# EAGLE schematic panel_controller_rev_c (EAGLE 5.06)

## Sheet 1 of 2
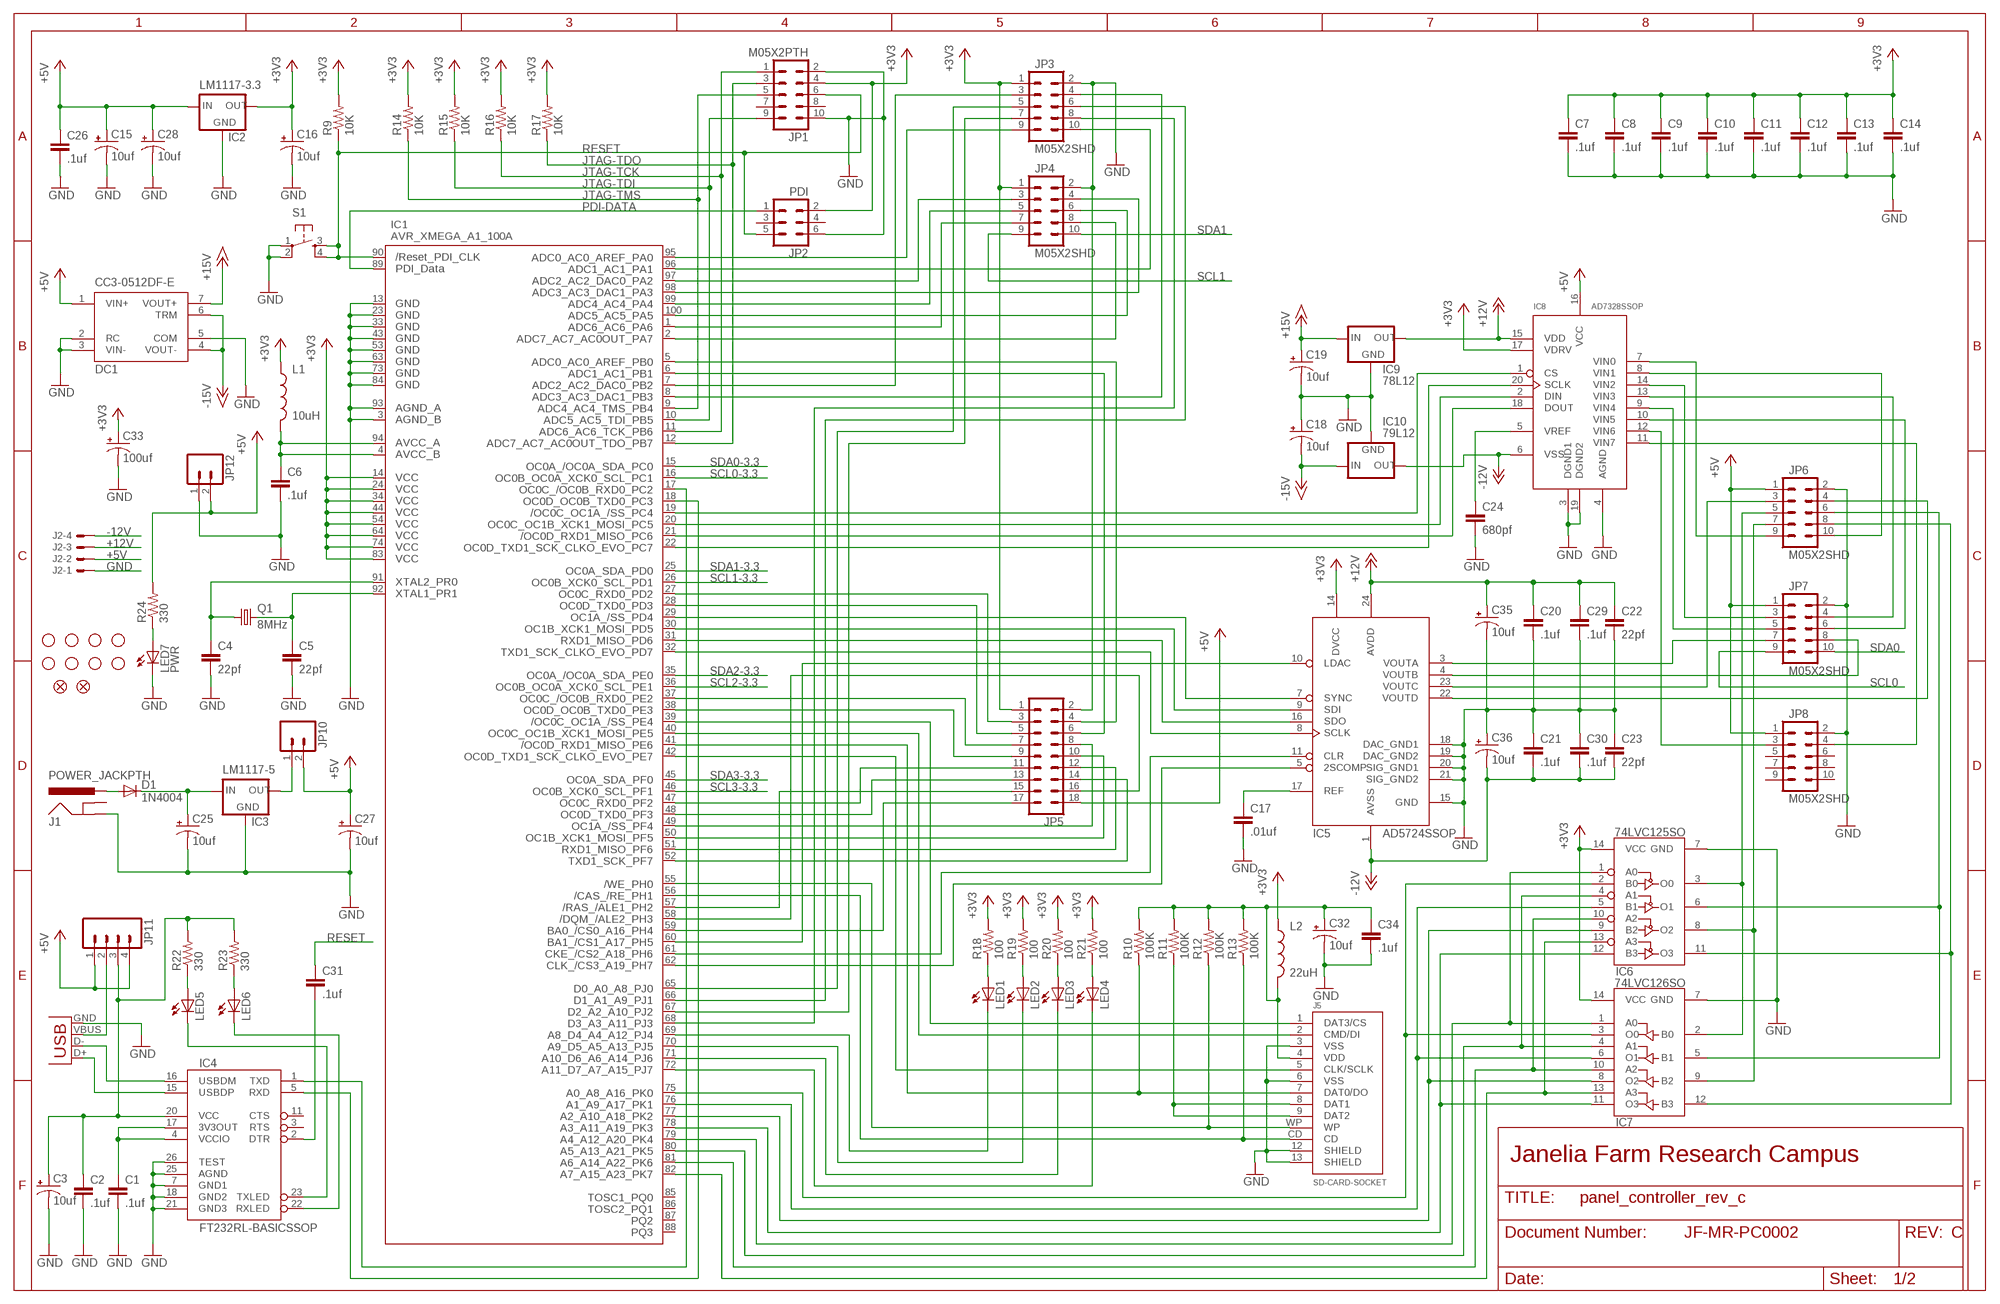
[diagram p0: schematic, sheet 1]

### Parts
C1  .1uf  CAP0603  [0603]
C2  .1uf  CAP0603  [0603]
C3  10uf  CAP_POL1206  [EIA3216]
C4  22pf  CAP0603  [0603]
C5  22pf  CAP0603  [0603]
C6  .1uf  CAP0603  [0603]
C7  .1uf  CAP0603  [0603]
C8  .1uf  CAP0603  [0603]
C9  .1uf  CAP0603  [0603]
C10  .1uf  CAP0603  [0603]
C11  .1uf  CAP0603  [0603]
C12  .1uf  CAP0603  [0603]
C13  .1uf  CAP0603  [0603]
C14  .1uf  CAP0603  [0603]
C15  10uf  CAP_POL1206  [EIA3216]
C16  10uf  CAP_POL1206  [EIA3216]
C17  .01uf  CAP0603  [0603]
C18  10uf  CAP_POL1206  [EIA3216]
C19  10uf  CAP_POL1206  [EIA3216]
C20  .1uf  CAP0603  [0603]
C21  .1uf  CAP0603  [0603]
C22  22pf  CAP0603  [0603]
C23  22pf  CAP0603  [0603]
C24  680pf  CAP0603  [0603]
C25  10uf  CAP_POL1206  [EIA3216]
C26  .1uf  CAP0603  [0603]
C27  10uf  CAP_POL1206  [EIA3216]
C28  10uf  CAP_POL1206  [EIA3216]
C29  .1uf  CAP0603  [0603]
C30  .1uf  CAP0603  [0603]
C31  .1uf  CAP0603  [0603]
C32  10uf  CAP_POL1206  [EIA3216]
C33  100uf  CAP_POLE  [PANASONIC_E]
C34  .1uf  CAP0603  [0603]
C35  10uf  CAP_POL1206  [EIA3216]
C36  10uf  CAP_POL1206  [EIA3216]
D1  1N4004  [DO41-10]
DC1  CC3-0512DF-E  [CC3-TH]
IC1  AVR_XMEGA_A1_100A  [TQFP100]
IC2  LM1117-3.3  V_REG_LM1117SOT223  [SOT223]
IC3  LM1117-5  V_REG_LM1117SOT223  [SOT223]
IC4  FT232RL-BASICSSOP  [SSOP28DB]
IC5  AD5724SSOP  [TSSOP24]
IC6  74LVC125SO  [SO014]
IC7  74LVC126SO  [SO014]
IC8  AD7328SSOP  [TSSOP20]
IC9  78L12  78LXXSOT89  [SOT89]
IC10  79L12  79LXXSOT89  [SOT89]
J1  POWER_JACKPTH  [POWER_JACK_PTH]
J2  KK-156-4  [KK-156-4]
J3  USBPTH  [USB-B-PTH]
J5  SD-CARD-SOCKET  [SD-MMC_SOCKET-3M]
JP1  M05X2PTH  MA05-2  [MA05-2]
JP2  PDI  MA03-2  [MA03-2]
JP3  M05X2SHD  [2X5-SHROUDED]
JP4  M05X2SHD  [2X5-SHROUDED]
JP5  MA09-2  [MA09-2]
JP6  M05X2SHD  [2X5-SHROUDED]
JP7  M05X2SHD  [2X5-SHROUDED]
JP8  M05X2SHD  [2X5-SHROUDED]
JP10  M02PTH  [1X02]
JP11  M04PTH  [1X04]
JP12  M02PTH  [1X02]
L1  10uH  INDUCTOR0805  [0805]
L2  22uH  INDUCTOR0805  [0805]
LED1  LED3MM  [LED3MM]
LED2  LED3MM  [LED3MM]
LED3  LED3MM  [LED3MM]
LED4  LED3MM  [LED3MM]
LED5  LED3MM  [LED3MM]
LED6  LED3MM  [LED3MM]
LED7  PWR  LED3MM  [LED3MM]
Q1  8MHz  CRYSTALSMD  [HC49UP]
R9  10K  RESISTOR0603  [0603]
R10  100K  RESISTOR0603  [0603]
R11  100K  RESISTOR0603  [0603]
R12  100K  RESISTOR0603  [0603]
R13  100K  RESISTOR0603  [0603]
R14  10K  RESISTOR0603  [0603]
R15  10K  RESISTOR0603  [0603]
R16  10K  RESISTOR0603  [0603]
R17  10K  RESISTOR0603  [0603]
R18  100  RESISTOR0603  [0603]
R19  100  RESISTOR0603  [0603]
R20  100  RESISTOR0603  [0603]
R21  100  RESISTOR0603  [0603]
R22  330  RESISTOR0603  [0603]
R23  330  RESISTOR0603  [0603]
R24  330  RESISTOR0603  [0603]
S1  TAC_SWITCHB3S-1000  [OMRON]
U$1  FIDUCIAL1X2  [FIDUCIAL-1X2]
U$2  FIDUCIAL1X2  [FIDUCIAL-1X2]
U$3  STAND-OFF  [STAND-OFF]
U$4  STAND-OFF  [STAND-OFF]
U$5  STAND-OFF  [STAND-OFF]
U$6  STAND-OFF  [STAND-OFF]
U$7  STAND-OFF  [STAND-OFF]
U$8  STAND-OFF  [STAND-OFF]
U$9  STAND-OFF  [STAND-OFF]
U$10  STAND-OFF  [STAND-OFF]

### Nets
+3V3 [power]: C7.1 C8.1 C9.1 C10.1 C11.1 C12.1 C13.1 C14.1 C16.A(+) C33.+ IC1.14(VCC1) IC1.24(VCC2) IC1.34(VCC3) IC1.44(VCC4) IC1.54(VCC5) IC1.64(VCC6) IC1.74(VCC7) IC1.83(VCC8) IC2.2(OUT) IC5.14(DVCC) IC6.14(VCC) IC7.14(VCC) IC8.17(VDRV) JP1.4 JP2.2 JP3.1 JP4.1 JP5.1 L1.1 L2.1 R9.2 R14.2 R15.2 R16.2 R17.2 R18.2 R19.2 R20.2 R21.2 ; also sheet 2
+5V [power]: C15.A(+) C26.1 C27.A(+) C28.A(+) DC1.1(VIN+) IC2.3(IN) IC8.16(VCC) J2.2 JP5.18 JP6.1 JP7.1 JP8.1 JP10.2 JP11.1 JP11.4 JP12.2 R24.2 ; also sheet 2
+12V [power]: C20.1 C22.1 C29.1 C35.A(+) IC5.24(AVDD) IC8.15(VDD) IC9.1(OUT) J2.3
+15V: C19.A(+) DC1.7(VOUT+) IC9.3(IN)
-12V [power]: C21.2 C23.2 C30.2 C36.C(-) IC5.1(AVSS) IC8.6(VSS) IC10.3(OUT) J2.4
-15V: C18.C(-) DC1.4(VOUT-) DC1.6(TRM) IC10.2(IN)
GND [power]: C1.2 C2.2 C3.C(-) C4.2 C5.2 C6.2 C7.2 C8.2 C9.2 C10.2 C11.2 C12.2 C13.2 C14.2 C15.C(-) C16.C(-) C17.2 C18.A(+) C19.C(-) C20.2 C21.1 C22.2 C23.1 C24.2 C25.C(-) C26.2 C27.C(-) C28.C(-) C29.2 C30.1 C32.C(-) C33.- C34.2 C35.C(-) C36.A(+) DC1.2(RC) DC1.3(VIN-) DC1.5(COM) IC1.3(AGND_B) IC1.13(GND1) IC1.23(GND2) IC1.33(GND3) IC1.43(GND4) IC1.53(GND5) IC1.63(GND6) IC1.73(GND7) IC1.84(GND8) IC1.93(AGND_A) IC2.1(GND) IC3.1(GND) IC4.7(GND1) IC4.18(GND2) IC4.21(GND3) IC4.25(AGND) IC4.26(TEST) IC5.15(GND) IC5.18(DAC_GND1) IC5.19(DAC_GND2) IC5.20(SIG_GND1) IC5.21(SIG_GND2) IC6.7(GND) IC7.7(GND) IC8.3(DGND1) IC8.4(AGND) IC8.19(DGND2) IC9.2(GND) IC10.1(GND) J1.GND J2.1 J3.GND J5.3(VSS) J5.6(VSS) J5.12(SHIELD) J5.13(SHIELD) JP1.2 JP1.10 JP2.6 JP3.2 JP4.2 JP5.2 JP6.2 JP7.2 JP8.2 JP12.1 LED7.K(C) S1.1 S1.2 ; also sheet 2
JTAG-TCK: IC1.11(PB6) JP1.1 R16.1
JTAG-TDI: IC1.10(PB5) JP1.9 R15.1
JTAG-TDO: IC1.12(PB7) JP1.3 R17.1
JTAG-TMS: IC1.9(PB4) JP1.5 R14.1
N$9: IC4.16(USBDM) J3.D-
N$10: IC4.15(USBDP) J3.D+
N$11: J3.VBUS JP11.2
N$12: C1.1 IC4.4(VCCIO) IC4.17(3V3OUT)
N$13: IC1.18(PC3) IC4.5(RXD)
N$14: IC1.19(PC4) IC8.1(CS)
N$15: IC1.57(PH2) JP5.15
N$16: IC1.65(PJ0) JP3.5
N$17: IC1.67(PJ2) JP3.7
N$18: IC1.17(PC2) IC4.1(TXD)
N$19: LED5.A R22.1
N$20: IC1.40(PE5) J5.2(CMD/DI)
N$21: IC1.41(PE6) J5.7(DAT0/DO) R10.1
N$22: IC1.42(PE7) J5.5(CLK/SCLK)
N$23: IC1.39(PE4) J5.1(DAT3/CS)
N$24: IC1.69(PJ4) LED1.K(C)
N$25: IC1.70(PJ5) LED2.K(C)
N$26: C4.1 IC1.91(PR0) Q1.1
N$27: C5.1 IC1.92(PR1) Q1.2
N$28: IC1.71(PJ6) LED3.K(C)
N$29: IC1.72(PJ7) LED4.K(C)
N$30: LED1.A R18.1
N$31: C6.1 IC1.4(AVCC_B) IC1.94(AVCC_A) L1.2
N$32: LED2.A R19.1
N$33: LED3.A R20.1
N$34: LED4.A R21.1
N$35: IC1.66(PJ1) JP3.6
N$36: IC1.68(PJ3) JP3.8
N$37: IC1.2(PA7) JP4.8
N$38: IC1.1(PA6) JP4.7
N$39: IC1.100(PA5) JP4.6
N$40: J5.8(DAT1) J5.9(DAT2) R11.1
N$41: IC1.55(PH0) J5.WP R12.1
N$42: IC1.56(PH1) J5.CD R13.1
N$43: IC1.99(PA4) JP4.5
N$44: IC1.98(PA3) JP4.4
N$45: IC1.97(PA2) JP4.3
N$46: IC1.96(PA1) JP3.10
N$47: IC1.95(PA0) JP3.9
N$48: IC1.7(PB2) JP3.3
N$49: IC1.8(PB3) JP3.4
N$50: IC1.20(PC5) IC8.2(DIN)
N$51: IC1.22(PC7) IC8.20(SCLK)
N$52: IC1.21(PC6) IC8.18(DOUT)
N$53: IC1.32(PD7) IC5.8(SCLK)
N$54: LED6.A R23.1
N$55: C24.1 IC8.5(VREF)
N$56: IC1.31(PD6) IC5.16(SDO)
N$57: IC1.30(PD5) IC5.9(SDI)
N$58: IC1.29(PD4) IC5.7(SYNC)
N$59: IC1.61(PH6) IC5.11(CLR)
N$60: C17.1 IC5.17(REF)
N$61: IC1.37(PE2) JP5.7
N$62: IC1.38(PE3) JP5.9
N$63: IC1.27(PD2) JP5.3
N$64: IC1.28(PD3) JP5.5
N$65: IC1.5(PB0) JP5.4
N$66: IC1.6(PB1) JP5.6
N$67: IC1.47(PF2) JP5.11
N$68: IC1.48(PF3) JP5.13
N$69: IC1.49(PF4) JP5.8
N$70: IC1.50(PF5) JP5.10
N$71: IC1.51(PF6) JP5.12
N$72: IC1.52(PF7) JP5.14
N$73: IC1.62(PH7) IC5.5(2SCOMP)
N$74: IC1.75(PK0) IC6.2(B0) IC7.3(O0)
N$75: IC1.76(PK1) IC6.5(B1) IC7.6(O1)
N$76: IC1.77(PK2) IC6.9(B2) IC7.8(O2)
N$77: IC1.78(PK3) IC6.12(B3) IC7.11(O3)
N$78: IC1.79(PK4) IC6.1(A0) IC7.1(A0)
N$79 [power]: C2.1 C3.A(+) IC4.20(VCC) JP11.3 R22.2 R23.2
N$80: IC4.22(RXLED) LED6.K(C)
N$81: IC1.60(PH5) IC5.10(LDAC)
N$82: IC8.11(VIN7) JP8.4
N$83: IC8.7(VIN0) JP6.9
N$84: IC8.8(VIN1) JP6.10
N$85: IC8.14(VIN2) JP7.3
N$86: IC8.13(VIN3) JP7.4
N$87: IC8.9(VIN4) JP7.5
N$88: IC8.10(VIN5) JP7.6
N$89: IC5.23(VOUTC) JP6.3
N$90: IC8.12(VIN6) JP8.3
N$91: IC5.3(VOUTA) JP7.7
N$92: IC5.4(VOUTB) JP7.8
N$93: IC5.22(VOUTD) JP6.4
N$94 [power]: C32.A(+) C34.1 J5.4(VDD) L2.2 R10.2 R11.2 R12.2 R13.2
N$95: IC1.80(PK5) IC6.4(A1) IC7.4(A1)
N$96: IC1.81(PK6) IC6.10(A2) IC7.10(A2)
N$97: IC1.82(PK7) IC6.13(A3) IC7.13(A3)
N$98: IC4.23(TXLED) LED5.K(C)
N$99: IC6.3(O0) IC7.2(B0) JP6.5
N$100: IC6.6(O1) IC7.5(B1) JP6.6
N$101: IC6.8(O2) IC7.9(B2) JP6.7
N$102: IC6.11(O3) IC7.12(B3) JP6.8
N$103: IC1.59(PH4) JP5.17
N$104: IC1.58(PH3) JP5.16
N$105: LED7.A R24.1
N$106: C31.2 IC4.2(DTR)
N$107: D1.A J1.PWR
N$108: C25.A(+) D1.C IC3.3(IN)
N$109: IC3.2(OUT) JP10.1
PDI-DATA: IC1.89(PDI_DATA) JP2.1
RESET: C31.1 IC1.90(RESET) JP1.6 JP2.5 R9.1 S1.3 S1.4
SCL0: JP7.9 ; also sheet 2
SCL0-3.3: IC1.16(PC1) ; also sheet 2
SCL1: JP4.9 ; also sheet 2
SCL1-3.3: IC1.26(PD1) ; also sheet 2
SCL2-3.3: IC1.36(PE1) ; also sheet 2
SCL3-3.3: IC1.46(PF1) ; also sheet 2
SDA0: JP7.10 ; also sheet 2
SDA0-3.3: IC1.15(PC0) ; also sheet 2
SDA1: JP4.10 ; also sheet 2
SDA1-3.3: IC1.25(PD0) ; also sheet 2
SDA2-3.3: IC1.35(PE0) ; also sheet 2
SDA3-3.3: IC1.45(PF0) ; also sheet 2
Unconnected: IC1.85(PQ0) IC1.86(PQ1) IC1.87(PQ2) IC1.88(PQ3) IC4.3(RTS) IC4.11(CTS) J1.GNDBREAK JP1.7 JP1.8 JP2.3 JP2.4 JP8.5 JP8.6 JP8.7 JP8.8 JP8.9 JP8.10

### Notes on the sheet
- Janelia Farm Research Campus
- JF-MR-PC0002 | C

## Sheet 2 of 2
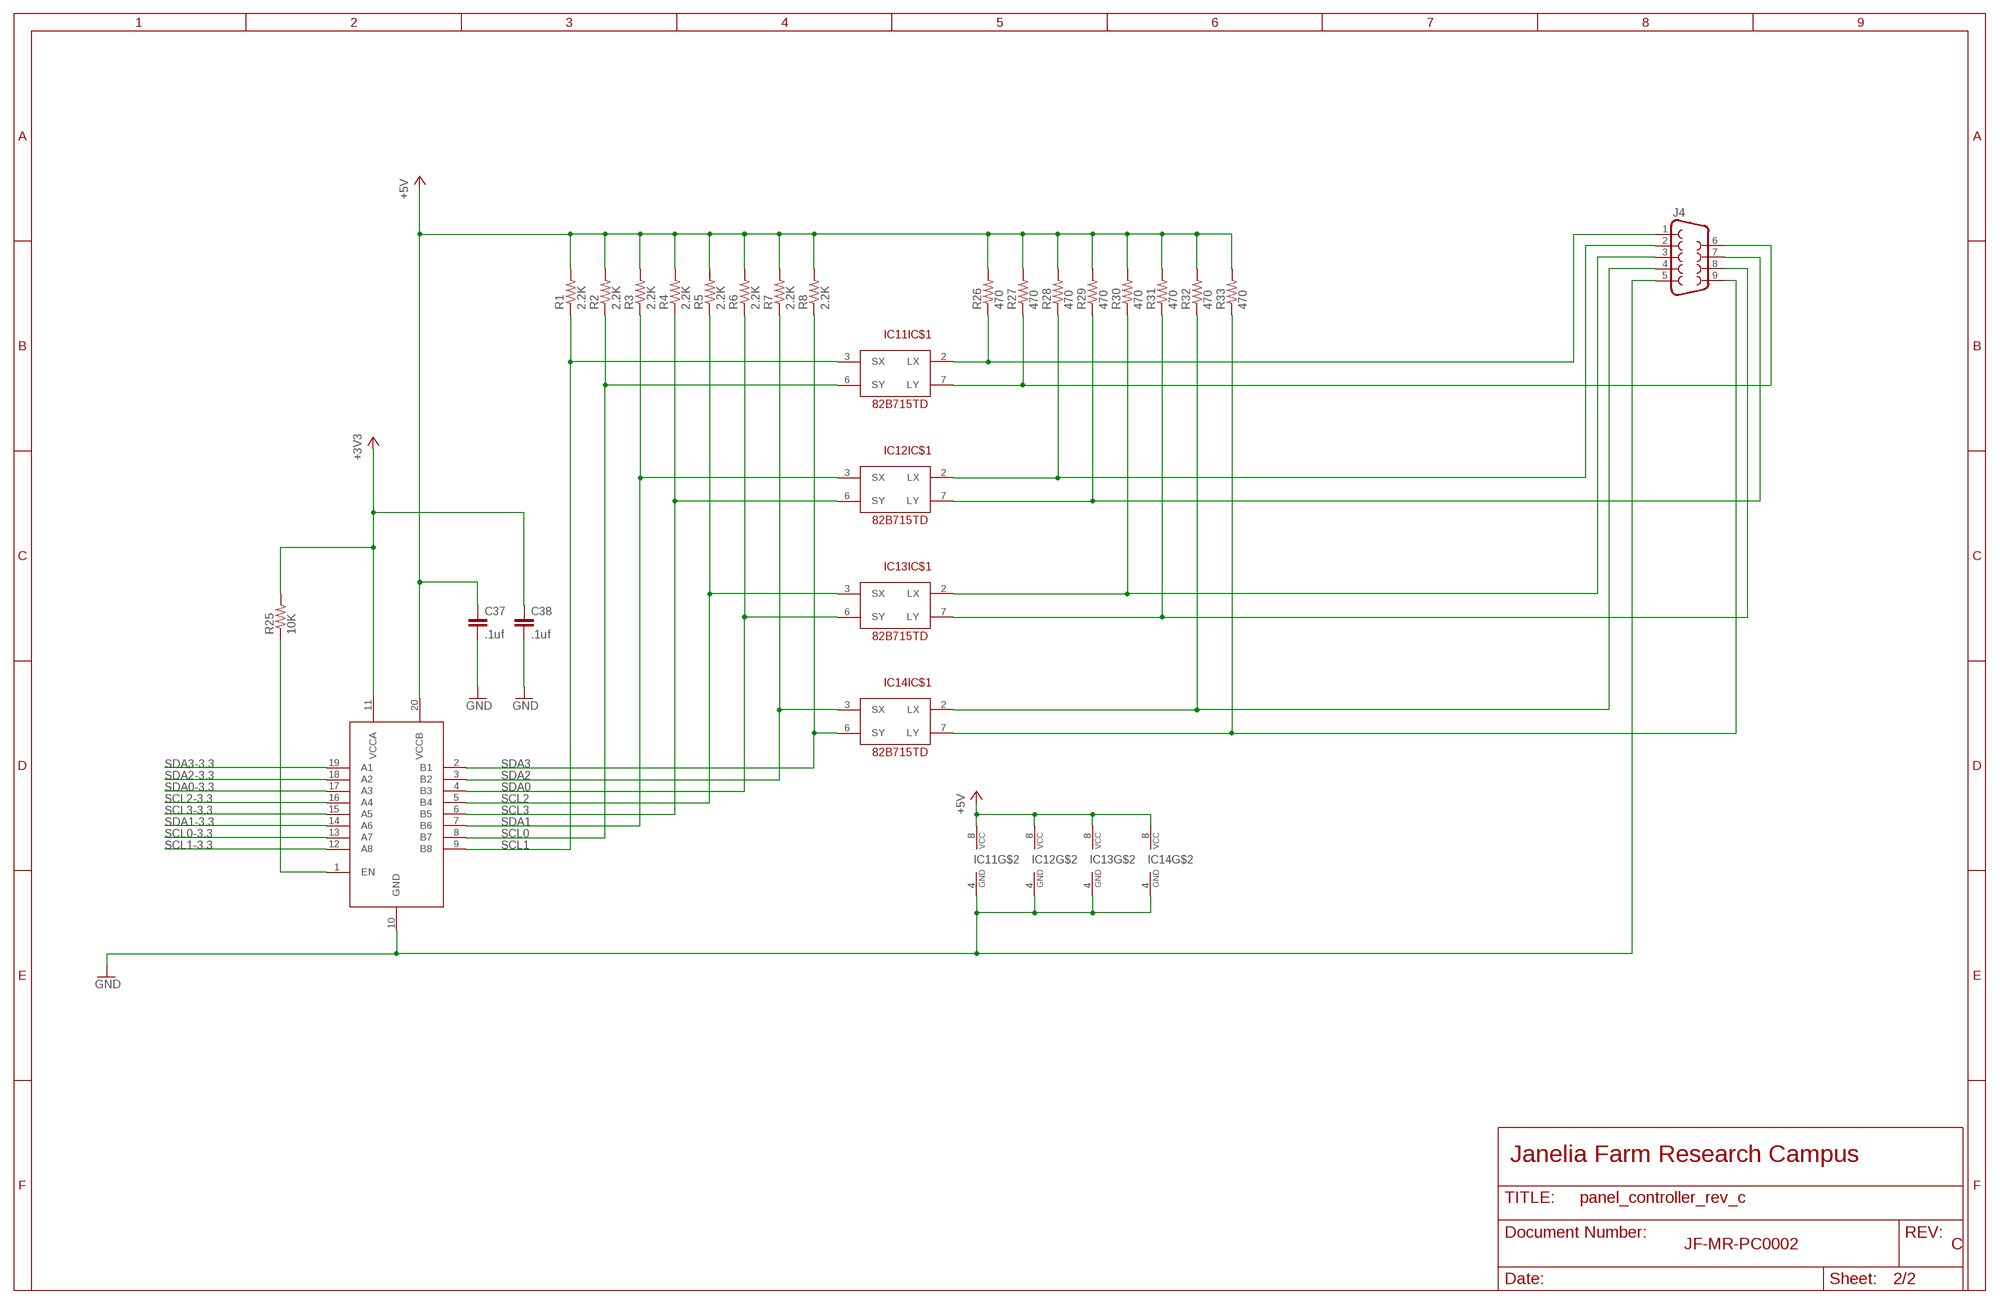
[diagram p1: schematic, sheet 2]

### Parts
C37  .1uf  CAP0603  [0603]
C38  .1uf  CAP0603  [0603]
IC11  82B715TD  [SO08]
IC12  82B715TD  [SO08]
IC13  82B715TD  [SO08]
IC14  82B715TD  [SO08]
IC15  PCA9519  [TSSOP20]
J4  DB9  [DB9]
R1  2.2K  RESISTOR0603  [0603]
R2  2.2K  RESISTOR0603  [0603]
R3  2.2K  RESISTOR0603  [0603]
R4  2.2K  RESISTOR0603  [0603]
R5  2.2K  RESISTOR0603  [0603]
R6  2.2K  RESISTOR0603  [0603]
R7  2.2K  RESISTOR0603  [0603]
R8  2.2K  RESISTOR0603  [0603]
R25  10K  RESISTOR0603  [0603]
R26  470  RESISTOR0603  [0603]
R27  470  RESISTOR0603  [0603]
R28  470  RESISTOR0603  [0603]
R29  470  RESISTOR0603  [0603]
R30  470  RESISTOR0603  [0603]
R31  470  RESISTOR0603  [0603]
R32  470  RESISTOR0603  [0603]
R33  470  RESISTOR0603  [0603]

### Nets
+3V3 [power]: C38.1 IC15.11(VCCA) R25.2 ; also sheet 1
+5V [power]: C37.1 IC11.8(VCC) IC12.8(VCC) IC13.8(VCC) IC14.8(VCC) IC15.20(VCCB) R1.2 R2.2 R3.2 R4.2 R5.2 R6.2 R7.2 R8.2 R26.2 R27.2 R28.2 R29.2 R30.2 R31.2 R32.2 R33.2 ; also sheet 1
GND [power]: C37.2 C38.2 IC11.4(GND) IC12.4(GND) IC13.4(GND) IC14.4(GND) IC15.10(GND) J4.5 ; also sheet 1
N$110: IC12.2(IC$1:LX) J4.2 R28.1
N$111: IC12.7(IC$1:LY) J4.7 R29.1
N$112: IC13.2(IC$1:LX) J4.3 R30.1
N$113: IC14.2(IC$1:LX) J4.4 R32.1
N$114: IC14.7(IC$1:LY) J4.9 R33.1
N$115: IC13.7(IC$1:LY) J4.8 R31.1
N$116: IC11.7(IC$1:LY) J4.6 R27.1
N$117: IC11.2(IC$1:LX) J4.1 R26.1
N$118: IC15.1(EN) R25.1
SCL0: IC11.6(IC$1:SY) IC15.8(B7) R2.1 ; also sheet 1
SCL0-3.3: IC15.13(A7) ; also sheet 1
SCL1: IC11.3(IC$1:SX) IC15.9(B8) R1.1 ; also sheet 1
SCL1-3.3: IC15.12(A8) ; also sheet 1
SCL2: IC13.3(IC$1:SX) IC15.5(B4) R5.1
SCL2-3.3: IC15.16(A4) ; also sheet 1
SCL3: IC12.6(IC$1:SY) IC15.6(B5) R4.1
SCL3-3.3: IC15.15(A5) ; also sheet 1
SDA0: IC13.6(IC$1:SY) IC15.4(B3) R6.1 ; also sheet 1
SDA0-3.3: IC15.17(A3) ; also sheet 1
SDA1: IC12.3(IC$1:SX) IC15.7(B6) R3.1 ; also sheet 1
SDA1-3.3: IC15.14(A6) ; also sheet 1
SDA2: IC14.3(IC$1:SX) IC15.3(B2) R7.1
SDA2-3.3: IC15.18(A2) ; also sheet 1
SDA3: IC14.6(IC$1:SY) IC15.2(B1) R8.1
SDA3-3.3: IC15.19(A1) ; also sheet 1

### Notes on the sheet
- Janelia Farm Research Campus
- JF-MR-PC0002 | C

## Library data of the parts
C1 C2 C4-C14 C17 C20-C24 C26 C29-C31 C34 C37 C38 = SparkFun:CAP: Capacitor Standard 0603 ceramic capacitor, and 0.1" leaded capacitor.
C3 C15 C16 C18 C19 C25 C27 C28 C32 C33 C35 C36 = SparkFun:CAP_POL: Capacitor Polarized These are standard SMD and PTH capacitors. Normally 10uF, 47uF, and 100uF in electrolytic and tantalum varieties. Always verify the external diameter of the through hole cap, it varies with capacity, voltage, and manufacturer. The EIA devices should be standard.
D1 = diode:1N4004: DIODE general purpose rectifier, 1 A
DC1 = jfrc:CC3-0512DF-E
IC1 = xmega:AVR_XMEGA_A1_: Device for Atmel AVR XMEGA A1 Series
IC2 IC3 = jfrc:V_REG_LM1117: Voltage Regulator LM1117 Standard adjustable voltage regulator but in SMD form.
IC4 = SparkFun:FT232RL-BASIC: USB UART This is the simplified version of the FT232RL unit. Only what you need, nothing you don't. Spark Fun Electronics SKU : COM-00650
IC5 = jfrc:AD5724SSOP
IC6 = jfrc:74LVC125
IC7 = jfrc:74LVC126
IC8 = jfrc:AD7328SSOP: AD7328 8ch A/D converter
IC9 = jfrc:78LXX: VOLTAGE REGULATOR
IC10 = jfrc:79LXX: VOLTAGE REGULATOR
IC11-IC14 = i2c_95xx:82B715: I²C Bus Extender
IC15 = jfrc:PCA9519
J1 = SparkFun:POWER_JACK: Power Jack This is the standard 5.5mm barrel jack for power. The PTH is the most common, proven, reliable, footprint. All others are experimental. The Slot footprint only works if the mill layer is transmitted to the PCB fab house so be warned. Spark Fun Electronics SKU : PRT-00119. Mating wall wart : TOL-00298 (and others)
J2 = con-molex:KK-156-4: KK 156 HEADER Source: http://www.molex.com/pdm_docs/sd/026604100_sd.pdf
J3 = SparkFun:USB: USB Connectors USB-B-PTH is fully proven SKU : PRT-00139 USB-miniB is fully proven SKU : PRT-00587 USB-A-PCB is untested. USB-A-H is throughly reviewed, but untested. Spark Fun Electronics SKU : PRT-00437 USB-B-SMT is throughly reviewed, but untested. Needs silkscreen touching up. USB-A-S has not been used/tested USB-MB-H has not been used/tested
J4 = SparkFun:DB9: DB9 Connector Standard DB9 (D-Sub 9) serial connector. Can be used for CAN bus as well as RS485 and RS232. Footprint production proven. Spark Fun Electronics SKU : PRT-00429
J5 = jfrc:SD-CARD-SOCKET
JP1 = con-lstb:MA05-2: PIN HEADER
JP2 = con-lstb:MA03-2: PIN HEADER
JP3 JP4 JP6-JP8 = SparkFun:M05X2: Header 5x2 Standard 10-pin dual row 0.1" header. Commonly used with AVR-ISP. Use with Spark Fun Electronics SKU: PRT-00778
JP5 = con-lstb:MA09-2: PIN HEADER
JP10 JP12 = SparkFun:M02: Header 2 Standard 2-pin 0.1" header. Use with straight break away headers (SKU : PRT-00116), right angle break away headers (PRT-00553), swiss pins (PRT-00743), machine pins (PRT-00117), and female headers (PRT-00115). Molex polarized connector foot print use with SKU : PRT-08233 with associated crimp pins and housings.
JP11 = SparkFun:M04: Header 4 Standard 4-pin 0.1" header. Use with straight break away headers (SKU : PRT-00116), right angle break away headers (PRT-00553), swiss pins (PRT-00743), machine pins (PRT-00117), and female headers (PRT-00115). Molex polarized connector foot print use with SKU : PRT-08231 with associated crimp pins and housings.
L1 L2 = jfrc:INDUCTOR: Inductors Basic Inductor/Choke - 0603 and 1206. Footprints are not proven and vary greatly between part numbers.
LED1-LED7 = SparkFun:LED: LEDs Standard schematic elements and footprints for 5mm, 3mm, 1206, and 0603 sized LEDs. 5mm - Spark Fun Electronics SKU : COM-00529 (and others)
Q1 = SparkFun:CRYSTAL: Crystals Various standard crystals. Proven footprints. Spark Fun Electronics SKU : COM-00534
R1-R33 = SparkFun:RESISTOR: Resistor Basic schematic elements and footprints for 0603, 1206, and PTH 1/10th watt (small) resistors.
S1 = jfrc:TAC_SWITCH: Momentary Switch Button commonly used for reset or general input. Spark Fun Electronics SKU : COM-00097
U$1 U$2 = SparkFun:FIDUCIAL: Fiducial Alignment Points Various fiducial points for machine vision alignment.
U$3-U$10 = SparkFun:STAND-OFF: Stand Off This is the mechanical footprint for a #4 phillips button head screw. Use the keepout ring to avoid running the screw head into surrounding components. SKU : PRT-00447

## Net classes
0 default: width 0.203 mm
1 power: width 0.254 mm